# Altium schematic sheet Ethernet.SchDoc
size A4; SheetNumber: 7; SheetTotal: 7
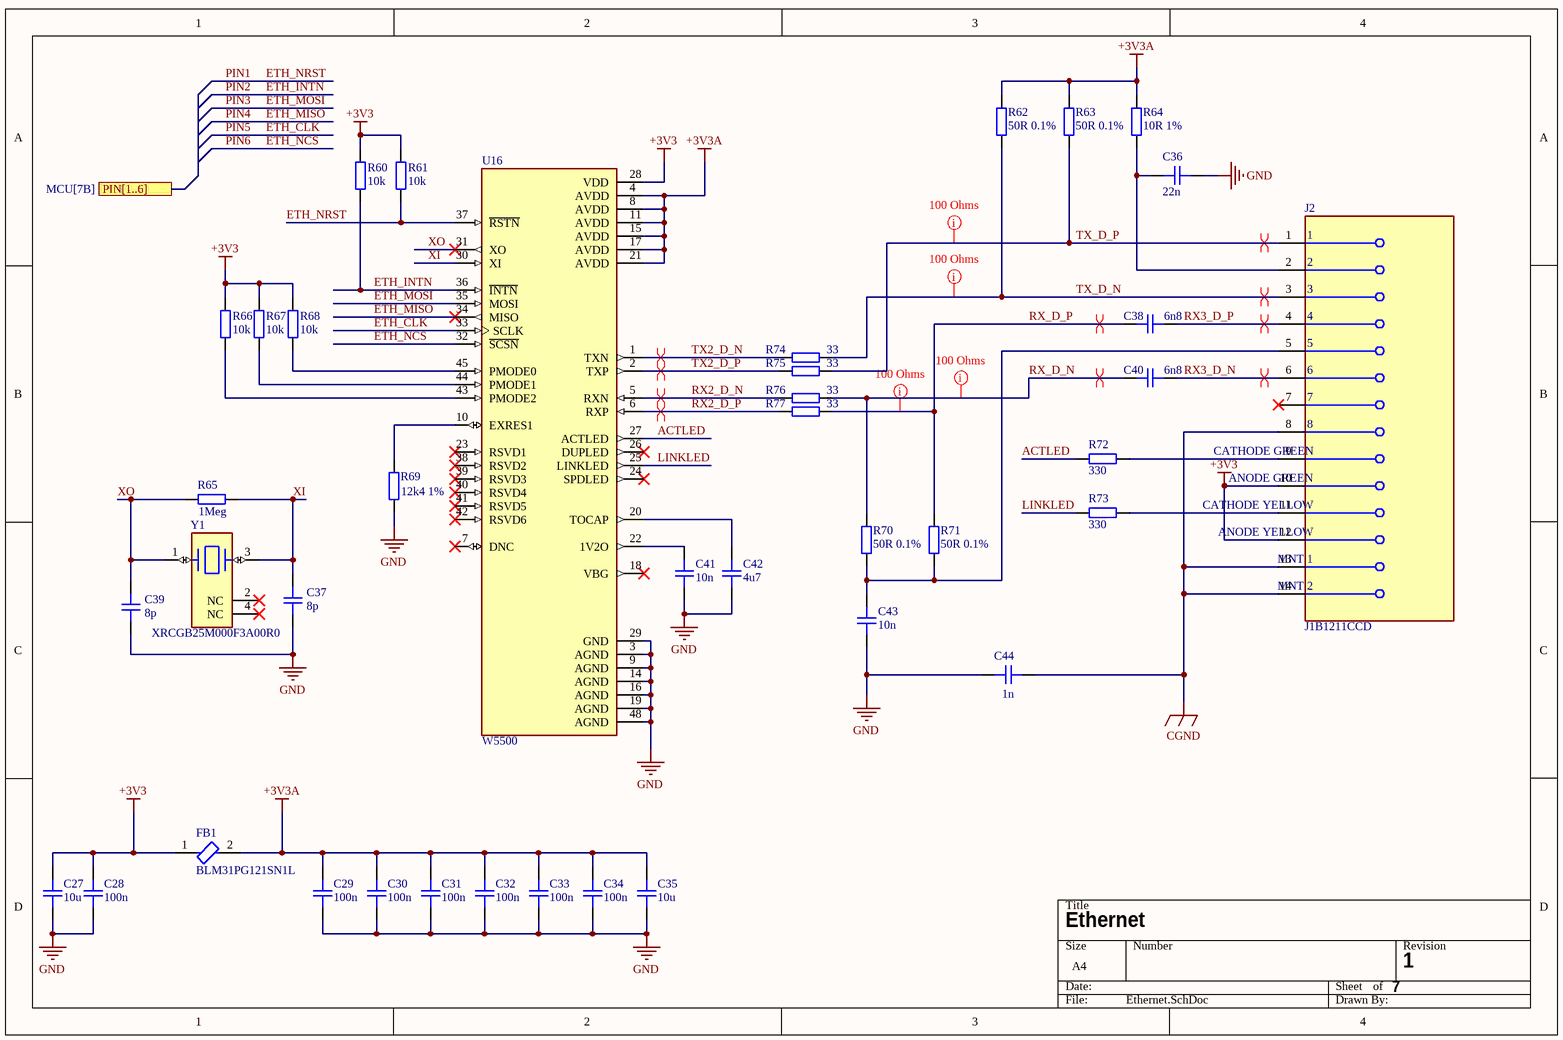
[diagram p0: Ethernet.SchDoc]

## Parts
C27  value 10u  [CAP_0402]  (hidden comment: CL05A106MQ5NUNC)
C28  Rating: 100n  [CAP_0402]  (hidden comment: CL05B104KB54PNC)
C29  Rating: 100n  [CAP_0402]  (hidden comment: CL05B104KB54PNC)
C30  Rating: 100n  [CAP_0402]  (hidden comment: CL05B104KB54PNC)
C31  Rating: 100n  [CAP_0402]  (hidden comment: CL05B104KB54PNC)
C32  Rating: 100n  [CAP_0402]  (hidden comment: CL05B104KB54PNC)
C33  Rating: 100n  [CAP_0402]  (hidden comment: CL05B104KB54PNC)
C34  Rating: 100n  [CAP_0402]  (hidden comment: CL05B104KB54PNC)
C35  value 10u  [CAP_0402]  (hidden comment: CL05A106MQ5NUNC)
C36  Rating: 22n  [CAP_0402]  (hidden comment: 0402B223K500NT)
C37  Rating: 8p  [CAP_0402]  (hidden comment: 0402CG8R0C500NT)
C38  Rating: 6n8  [CAP_0402]  (hidden comment: 0402B682K500NT)
C39  Rating: 8p  [CAP_0402]  (hidden comment: 0402CG8R0C500NT)
C40  Rating: 6n8  [CAP_0402]  (hidden comment: 0402B682K500NT)
C41  Rating: 10n  [CAP_0402]  (hidden comment: CL05B103KB5NNNC)
C42  Rating: 4u7  [CAP_0402]  (hidden comment: CL05A475MP5NRNC)
C43  Rating: 10n  [CAP_0402]  (hidden comment: CL05B103KB5NNNC)
C44  Rating: 1n  [CAP_0402]  (hidden comment: CC0402KRX7R0BB102)
FB1  BLM31PG121SN1L  [FP-BLM31-0_2-t1_1-MFG]
J2  J1B1211CCD  [FP-J1B1211CCD-MFG]
R60  value 10k  [RES_0402]  (hidden comment: 0402WGF1002TCE)
R61  value 10k  [RES_0402]  (hidden comment: 0402WGF1002TCE)
R62  Resistance: 50R 0.1%  [RES_0402]  (hidden comment: RT0402BRE0750RL)
R63  Resistance: 50R 0.1%  [RES_0402]  (hidden comment: RT0402BRE0750RL)
R64  Parameter: 10R 1%  [RES_0402]  (hidden comment: 0402WGF100JTCE)
R65  Resistance: 1Meg  [RES_0402]  (hidden comment: 0402WGF1004TCE)
R66  value 10k  [RES_0402]  (hidden comment: 0402WGF1002TCE)
R67  value 10k  [RES_0402]  (hidden comment: 0402WGF1002TCE)
R68  value 10k  [RES_0402]  (hidden comment: 0402WGF1002TCE)
R69  Resistance: 12k4 1%  [RES_0402]  (hidden comment: 0402WGF1242TCE)
R70  Resistance: 50R 0.1%  [RES_0402]  (hidden comment: RT0402BRE0750RL)
R71  Resistance: 50R 0.1%  [RES_0402]  (hidden comment: RT0402BRE0750RL)
R72  Resistance: 330  [RES_0402]  (hidden comment: 0402WGF3300TCE)
R73  Resistance: 330  [RES_0402]  (hidden comment: 0402WGF3300TCE)
R74  Resistance: 33  [RES_0402]  (hidden comment: 0402WGF330JTCE)
R75  Resistance: 33  [RES_0402]  (hidden comment: 0402WGF330JTCE)
R76  Resistance: 33  [RES_0402]  (hidden comment: 0402WGF330JTCE)
R77  Resistance: 33  [RES_0402]  (hidden comment: 0402WGF330JTCE)
U16  W5500  [QFP50P900X900X160-48N]
Y1  XRCGB25M000F3A00R0  [FP-XRCGB-MFG]

## Ports
PIN[1..6] (see MCU[7B])

## Nets
+3V3: C27.1 C28.2 FB1.1 J2.10(ANODE_GREEN) J2.12(ANODE_YELLOW) R60.2 R61.2 R66.2 R67.2 R68.2 U16.28(VDD)
+3V3A: C29.1 C30.1 C31.1 C32.1 C33.1 C34.1 C35.1 FB1.2 R62.2 R63.2 R64.2 U16.4(AVDD) U16.8(AVDD) U16.11(AVDD) U16.15(AVDD) U16.17(AVDD) U16.21(AVDD)
CGND: C44.2 J2.8 J2.13(MNT_1) J2.14(MNT_2)
GND: C27.2 C28.1 C29.2 C30.2 C31.2 C32.2 C33.2 C34.2 C35.2 C36.1 C37.1 C39.1 C41.1 C42.1 C43.1 C44.1 R69.1 U16.3(AGND) U16.9(AGND) U16.14(AGND) U16.16(AGND) U16.19(AGND) U16.29(GND) U16.48(AGND)
ACTLED: R72.2 U16.27(ACTLED)
ETH_CLK: U16.33(SCLK)  [also labelled PIN5]
ETH_INTN: R60.1 U16.36(~{INTN})  [also labelled PIN2]
ETH_MISO: U16.34(MISO)  [also labelled PIN4]
ETH_MOSI: U16.35(MOSI)  [also labelled PIN3]
ETH_NCS: U16.32(~{SCSN})  [also labelled PIN6]
ETH_NRST: R61.1 U16.37(~{RSTN})  [also labelled PIN1]
LINKLED: R73.2 U16.25(LINKLED)
RX2_D_N: R76.1 U16.5(RXN)
RX2_D_P: R77.1 U16.6(RXP)
RX3_D_N: C40.1 J2.6
RX3_D_P: C38.1 J2.4
RX_D_N: C40.2 R70.2 R76.2
RX_D_P: C38.2 R71.2 R77.2
TX2_D_N: R74.1 U16.1(TXN)
TX2_D_P: R75.1 U16.2(TXP)
TX_D_N: J2.3 R62.1 R74.2
TX_D_P: J2.1 R63.1 R75.2
XI: C37.2 R65.2 U16.30(XI) Y1.3(Input/Output)
XO: C39.2 R65.1 U16.31(XO) Y1.1(Input/Output)
NetC36_2: C36.2 J2.2 R64.1
NetC41_2: C41.2 U16.22(1V2O)
NetC42_2: C42.2 U16.20(TOCAP)
NetC43_2: C43.2 J2.5 R70.1 R71.1
NetJ2_9: J2.9(CATHODE_GREEN) R72.1
NetJ2_11: J2.11(CATHODE_YELLOW) R73.1
NetR66_1: R66.1 U16.43(PMODE2)
NetR67_1: R67.1 U16.44(PMODE1)
NetR68_1: R68.1 U16.45(PMODE0)
NetR69_2: R69.2 U16.10(EXRES1)

Not connected (* = marked no-connect by the designer): J2 7*; U16 7(DNC)* 18(VBG)* 23(RSVD1)* 24(SPDLED)* 26(DUPLED)* 38(RSVD2)* 39(RSVD3)* 40(RSVD4)* 41(RSVD5)* 42(RSVD6)*; Y1 2(NC)* 4(NC)*

## Layout directives
differential pair: RX2_D_N, RX2_D_P, RX3_D_N, RX3_D_P, RX_D_N, RX_D_P, TX2_D_N, TX2_D_P, TX_D_N, TX_D_P
mark named 100 Ohms: RX_D_N, RX_D_P, TX_D_N, TX_D_P

## Notes on the sheet
- Ethernet
- 7
- 1
- PROJECT DESCRIPTION
- ENG:
- APPROVALS
- DATE
- PROJECT
- DSN:
- CHK:
- REFERENCE DOCUMENTS
- TITLE
- BOM:
- FAB DWG:
- PCB DWG:
- ASSY DWG:
- SCALE:
- FILE NAME
- SHEET
- OF
- REV

## Library data of the parts
C27-C43 = CAP_0402: Capacitor SMD 0402; Manufacturer: *; Manufacturer Part Number: *; Distributor Link: *; LCSC: *; Dielectric: *
C44 = CAP_0402: Capacitor SMD 0402 100V; Manufacturer: *; Manufacturer Part Number: *; Distributor Link: *; LCSC: *; Dielectric: *
FB1 = CMP-0686-00732-3: Chip Ferrite Bead Array, 1206, 120Ω @ 100MHz, 0.02Ω, 25%, 3.5A; Number of Lines: 1; DC Current: 3A; Impedance: 120R; Material: Steel; DC Resistance (DCR): 20mR; Shielding: Unshielded; Number of Pins: 2; Case Code (Metric): 3216; Contact Plating: Tin; Radiation Hardening: No; Termination: SMD/SMT; Lead Free: Lead Free; Core Material: Ferrite; Case Code (Imperial): 1206; Test Frequency: 100MHz; Depth: 1.6mm; Max Operating Temperature: 125°C; Package Quantity: 3000; Packaging: Tape and Reel; Min Operating Temperature: -55°C; Length: 3.2mm; Current Rating: 3.5A; RoHS Compliant: Yes; Tolerance: 25%; Width: 1.6mm; Max Current Rating: 3.5A; Frequency: 100MHz; Military Standard: Not; Case/Package: 1206; Max DC Current: 3A; Height: 1.1mm
J2 = CMP-240752-000001-1: CONN JACK 1PORT 100 BASE-T PCB; Number of Cores per Jack: 4; Direction: Down; Connector Type: RJ45; Shielding: Shielded; Number of Ports: 1; Termination: Solder; Packaging: Bulk; Contact Material: Brass; Color: Green; Number of Rows: 1; Mount: Through Hole; Series: -; Contact Plating: Gold; Max Operating Temperature: 85°C; Min Operating Temperature: -40°C; Housing Material: Thermoplastic
R60-R77 = RES_0402: Resistor SMD 0402; Manufacturer: *; Manufacturer Part Number: *; Distributor Link: *; LCSC: *
U16 = W5500: Hardwired TCP/IP embedded Ethernet controller; Availability: Unavailable; MP: W5500; Value: *; Price: None; Package: None
Y1 = CMP-06054-000016-1: CRYSTAL 25.0000MHZ 6PF SMD; Frequency Tolerance: 35ppm; Frequency: 25MHz; Frequency Stability: 100ppm; ESR (Equivalent Series Resistance): 100R; Ratings: AEC-Q200; Packaging: Tape and Reel; Case/Package: SMD/SMT; Length: 0.079inch; Mount: Surface Mount; Max Operating Temperature: 125°C; Height: 0.028inch; Min Operating Temperature: -40°C; Width: 0.063inch; Load Capacitance: 6pF